# Altium schematic sheet LPCB218 - HE INTERFACE TOP.SchDoc
size A3; Address1: Factory 10; Address2: 9-13 Dingley Avenue, Dandeong, VICTORIA 3175, AUSTRALIA; DocumentNumber: 5; Revision: 1; SheetNumber: 5; SheetTotal: 14; Lockie__PCB_SUB_ASSEMBLY: HE Interface; Lockie__PCB_ASSEMBLY: Command Node; Lockie__LDL: LPCB218; Lockie__PCB_DESCRIPTION: Command Node
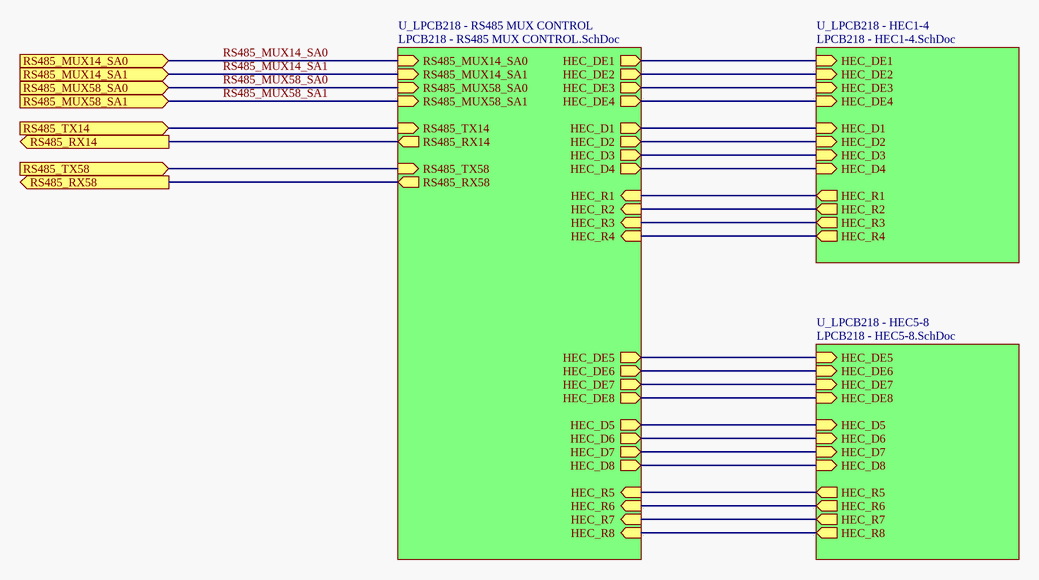
[diagram p0: LPCB218 - HE INTERFACE TOP.SchDoc]

## Sub-sheets
U_LPCB218 - HEC1-4 = LPCB218 - HEC1-4.SchDoc: HEC_R1 (out), HEC_D1 (in), HEC_DE1 (in), HEC_R2 (out), HEC_D2 (in), HEC_DE2 (in), HEC_R3 (out), HEC_D3 (in), HEC_DE3 (in), HEC_R4 (out), HEC_D4 (in), HEC_DE4 (in)
U_LPCB218 - HEC5-8 = LPCB218 - HEC5-8.SchDoc: HEC_R5 (out), HEC_D5 (in), HEC_DE5 (in), HEC_R6 (out), HEC_D6 (in), HEC_DE6 (in), HEC_R7 (out), HEC_D7 (in), HEC_DE7 (in), HEC_R8 (out), HEC_D8 (in), HEC_DE8 (in)
U_LPCB218 - RS485 MUX CONTROL = LPCB218 - RS485 MUX CONTROL.SchDoc: RS485_MUX14_SA0 (in), RS485_MUX14_SA1 (in), RS485_MUX58_SA0 (in), RS485_MUX58_SA1 (in), HEC_DE1 (out), HEC_DE2 (out), HEC_DE3 (out), HEC_DE4 (out), HEC_DE5 (out), HEC_DE6 (out), HEC_DE7 (out), HEC_DE8 (out), RS485_RX14 (out), RS485_TX14 (in), HEC_R1 (in), HEC_R2 (in), HEC_R3 (in), HEC_R4 (in), HEC_D1 (out), HEC_D2 (out), HEC_D3 (out), HEC_D4 (out), RS485_RX58 (out), RS485_TX58 (in), HEC_R5 (in), HEC_D5 (out), HEC_R6 (in), HEC_R7 (in), HEC_R8 (in), HEC_D6 (out), HEC_D7 (out), HEC_D8 (out)

## Ports
RS485_MUX14_SA0 (in), RS485_MUX14_SA1 (in), RS485_MUX58_SA0 (in), RS485_MUX58_SA1 (in), RS485_RX14 (out), RS485_RX58 (out), RS485_TX14 (in), RS485_TX58 (in)

## Nets
RS485_MUX14_SA0: port RS485_MUX14_SA0, sheet U_LPCB218 - RS485 MUX CONTROL/RS485_MUX14_SA0
RS485_MUX14_SA1: port RS485_MUX14_SA1, sheet U_LPCB218 - RS485 MUX CONTROL/RS485_MUX14_SA1
RS485_MUX58_SA0: port RS485_MUX58_SA0, sheet U_LPCB218 - RS485 MUX CONTROL/RS485_MUX58_SA0
RS485_MUX58_SA1: port RS485_MUX58_SA1, sheet U_LPCB218 - RS485 MUX CONTROL/RS485_MUX58_SA1
RS485_RX14: port RS485_RX14, sheet U_LPCB218 - RS485 MUX CONTROL/RS485_RX14
RS485_RX58: port RS485_RX58, sheet U_LPCB218 - RS485 MUX CONTROL/RS485_RX58
RS485_TX14: port RS485_TX14, sheet U_LPCB218 - RS485 MUX CONTROL/RS485_TX14
RS485_TX58: port RS485_TX58, sheet U_LPCB218 - RS485 MUX CONTROL/RS485_TX58
(unnamed): sheet U_LPCB218 - RS485 MUX CONTROL/HEC_DE1, sheet U_LPCB218 - HEC1-4/HEC_DE1
(unnamed): sheet U_LPCB218 - RS485 MUX CONTROL/HEC_DE2, sheet U_LPCB218 - HEC1-4/HEC_DE2
(unnamed): sheet U_LPCB218 - RS485 MUX CONTROL/HEC_DE3, sheet U_LPCB218 - HEC1-4/HEC_DE3
(unnamed): sheet U_LPCB218 - RS485 MUX CONTROL/HEC_DE4, sheet U_LPCB218 - HEC1-4/HEC_DE4
(unnamed): sheet U_LPCB218 - RS485 MUX CONTROL/HEC_DE5, sheet U_LPCB218 - HEC5-8/HEC_DE5
(unnamed): sheet U_LPCB218 - RS485 MUX CONTROL/HEC_DE6, sheet U_LPCB218 - HEC5-8/HEC_DE6
(unnamed): sheet U_LPCB218 - RS485 MUX CONTROL/HEC_DE7, sheet U_LPCB218 - HEC5-8/HEC_DE7
(unnamed): sheet U_LPCB218 - RS485 MUX CONTROL/HEC_DE8, sheet U_LPCB218 - HEC5-8/HEC_DE8
(unnamed): sheet U_LPCB218 - RS485 MUX CONTROL/HEC_R1, sheet U_LPCB218 - HEC1-4/HEC_R1
(unnamed): sheet U_LPCB218 - RS485 MUX CONTROL/HEC_R2, sheet U_LPCB218 - HEC1-4/HEC_R2
(unnamed): sheet U_LPCB218 - RS485 MUX CONTROL/HEC_R3, sheet U_LPCB218 - HEC1-4/HEC_R3
(unnamed): sheet U_LPCB218 - RS485 MUX CONTROL/HEC_R4, sheet U_LPCB218 - HEC1-4/HEC_R4
(unnamed): sheet U_LPCB218 - RS485 MUX CONTROL/HEC_D1, sheet U_LPCB218 - HEC1-4/HEC_D1
(unnamed): sheet U_LPCB218 - RS485 MUX CONTROL/HEC_D2, sheet U_LPCB218 - HEC1-4/HEC_D2
(unnamed): sheet U_LPCB218 - RS485 MUX CONTROL/HEC_D3, sheet U_LPCB218 - HEC1-4/HEC_D3
(unnamed): sheet U_LPCB218 - RS485 MUX CONTROL/HEC_D4, sheet U_LPCB218 - HEC1-4/HEC_D4
(unnamed): sheet U_LPCB218 - RS485 MUX CONTROL/HEC_R5, sheet U_LPCB218 - HEC5-8/HEC_R5
(unnamed): sheet U_LPCB218 - RS485 MUX CONTROL/HEC_D5, sheet U_LPCB218 - HEC5-8/HEC_D5
(unnamed): sheet U_LPCB218 - RS485 MUX CONTROL/HEC_R6, sheet U_LPCB218 - HEC5-8/HEC_R6
(unnamed): sheet U_LPCB218 - RS485 MUX CONTROL/HEC_R7, sheet U_LPCB218 - HEC5-8/HEC_R7
(unnamed): sheet U_LPCB218 - RS485 MUX CONTROL/HEC_R8, sheet U_LPCB218 - HEC5-8/HEC_R8
(unnamed): sheet U_LPCB218 - RS485 MUX CONTROL/HEC_D6, sheet U_LPCB218 - HEC5-8/HEC_D6
(unnamed): sheet U_LPCB218 - RS485 MUX CONTROL/HEC_D7, sheet U_LPCB218 - HEC5-8/HEC_D7
(unnamed): sheet U_LPCB218 - RS485 MUX CONTROL/HEC_D8, sheet U_LPCB218 - HEC5-8/HEC_D8

## Notes on the sheet
- PCB COMPONENT DESCRIPTION
- LDL NUMBER
- Assembly Details
- Size
- Drawing File Name
- Revision
- http://rloop.org
- Scale
- A3
- Sheet Details
- N.T.S
- Sheet:
- Of: